# Altium schematic sheet Multi-sensor Datalogger.SchDoc
size A3
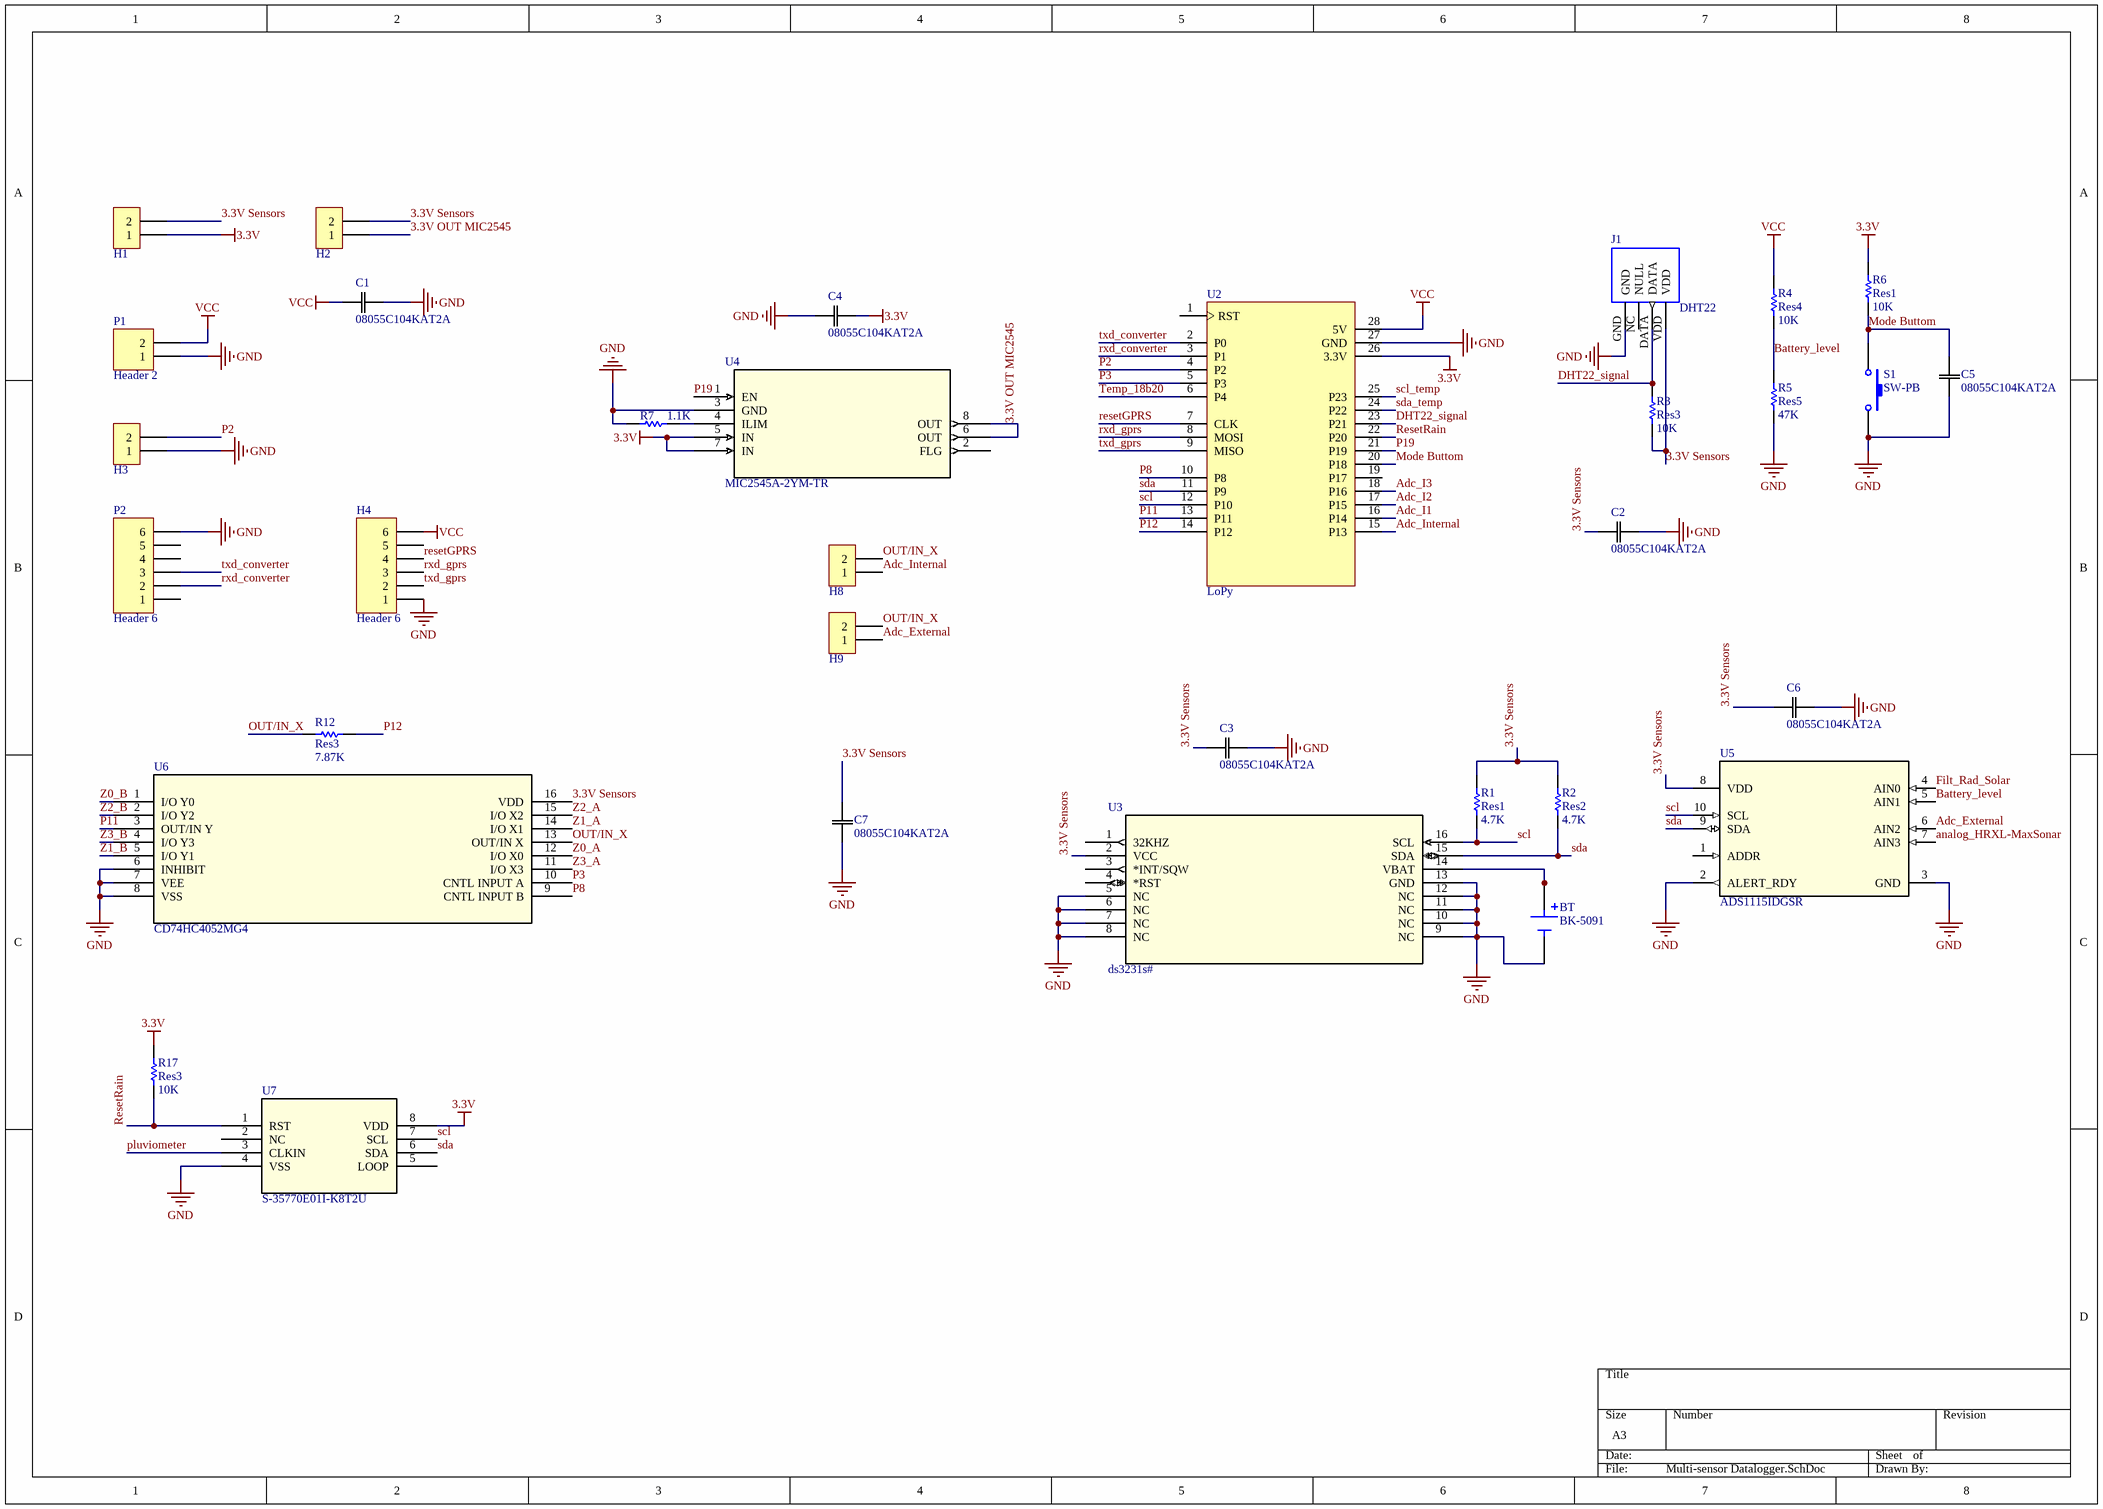
[diagram p0: Multi-sensor Datalogger.SchDoc]

## Parts
BT  BK-5091  [BAT_BK-5091]
C1  08055C104KAT2A  [CAP_X7R_0805_AVX]
C2  08055C104KAT2A  [CAP_X7R_0805_AVX]
C3  08055C104KAT2A  [CAP_X7R_0805_AVX]
C4  08055C104KAT2A  [CAP_X7R_0805_AVX]
C5  08055C104KAT2A  [CAP_X7R_0805_AVX]
C6  08055C104KAT2A  [CAP_X7R_0805_AVX]
C7  08055C104KAT2A  [CAP_X7R_0805_AVX]
H1  Header  [Header 1X2]  (value not drawn)
H2  Header  [Header 1X2]  (value not drawn)
H3  Header  [Header 1X2]  (value not drawn)
H4  Header 6  [Header 1X6]
H8  Header  [Header 1X2]  (value not drawn)
H9  Header  [Header 1X2]  (value not drawn)
J1  DHT22  [DHT22]
P1  Header 2  [BORNERA25-2]
P2  Header 6  [HDR1X6]
R1  Res1  value 4.7K  [6-0805_N]
R2  Res2  value 4.7K  [6-0805_N]
R3  Res3  value 10K  [6-0805_N]
R4  Res4  value 10K  [6-0805_N]
R5  Res5  value 47K  [6-0805_N]
R6  Res1  value 10K  [6-0805_N]
R7  value 1.1K  [6-0805_N]
R12  Res3  value 7.87K  [6-0805_N]
R17  Res3  value 10K  [6-0805_N]
S1  SW-PB  [BUTTON-1-SMD]
U2  LoPy  [LoPy]
U3  ds3231s#  [21-0042B_16_MXM]
U4  MIC2545A-2YM-TR  [SOP-8_MCH]
U5  ADS1115IDGSR  [DGS0010A_L]
U6  CD74HC4052MG4  [D16_TEX]
U7  S-35770E01I-K8T2U  [TMSOP08_2P9X2P8_ABL]

## Nets
3.3V: C4.1 H1.1 R6.1 R17.1 U2.26(3.3V) U4.5(IN) U4.7(IN) U7.8(VDD)
GND: BT.NEG C1.1 C2.1 C3.1 C4.2 C5.1 C6.1 C7.1 H3.1 H4.1 J1.GND P1.1 P2.6 R5.2 R7.1 S1.2 U2.27(GND) U3.5(NC) U3.6(NC) U3.7(NC) U3.8(NC) U3.9(NC) U3.10(NC) U3.11(NC) U3.12(NC) U3.13(GND) U4.3(GND) U5.2(ALERT_RDY) U5.3(GND) U6.6(INHIBIT) U6.7(VEE) U6.8(VSS) U7.4(VSS)
VCC: C1.2 H4.6 P1.2 R4.1 U2.28(5V)
3.3V OUT MIC2545: H2.1 U4.6(OUT) U4.8(OUT)
3.3V Sensors: C2.2 C3.2 C6.2 C7.2 H1.2 H2.2 J1.VDD R1.1 R2.1 R3.2 U3.2(VCC) U5.8(VDD) U6.16(VDD)
Adc_External: H9.1 U5.6(AIN2)
Adc_I1: U2.16(P14)
Adc_I2: U2.17(P15)
Adc_I3: U2.18(P16)
Adc_Internal: H8.1 U2.15(P13)
analog_HRXL-MaxSonar: U5.7(AIN3)
Battery_level: R4.2 R5.1 U5.5(AIN1)
DHT22_signal: J1.DATA R3.1 U2.23(P21)
Filt_Rad_Solar: U5.4(AIN0)
Mode Buttom: C5.2 R6.2 S1.1 U2.20(P18)
OUT/IN_X: H8.2 H9.2 R12.1 U6.13(OUT/IN_X)
P2: H3.2 U2.4(P2)
P3: U2.5(P3) U6.10(CNTL_INPUT_A)
P8: U2.10(P8) U6.9(CNTL_INPUT_B)
P11: U2.13(P11) U6.3(OUT/IN_Y)
P12: R12.2 U2.14(P12)
P19: U2.21(P19) U4.1(EN)
pluviometer: U7.3(CLKIN)
resetGPRS: H4.4 U2.7(CLK)
ResetRain: R17.2 U2.22(P20) U7.1(RST)
rxd_converter: P2.2 U2.3(P1)
rxd_gprs: H4.3 U2.8(MOSI)
scl: R1.2 U2.12(P10) U3.16(SCL) U5.10(SCL) U7.7(SCL)
scl_temp: U2.25(P23)
sda: R2.2 U2.11(P9) U3.15(SDA) U5.9(SDA) U7.6(SDA)
sda_temp: U2.24(P22)
Temp_18b20: U2.6(P4)
txd_converter: P2.3 U2.2(P0)
txd_gprs: H4.2 U2.9(MISO)
Z0_A: U6.12(I/O_X0)
Z0_B: U6.1(I/O_Y0)
Z1_A: U6.14(I/O_X1)
Z1_B: U6.5(I/O_Y1)
Z2_A: U6.15(I/O_X2)
Z2_B: U6.2(I/O_Y2)
Z3_A: U6.11(I/O_X3)
Z3_B: U6.4(I/O_Y3)
NetBT_1+: BT.1+(POS) BT.2+(POS) U3.14(VBAT)
NetR7_2: R7.2 U4.4(ILIM)

Not connected (* = marked no-connect by the designer): H4 5; J1 NC(NULL); P2 1 4 5; U2 1(RST) 19(P17); U3 1(32KHZ) 3(*INT/SQW) 4(*RST); U4 2(FLG); U5 1(ADDR); U7 2(NC) 5(LOOP)

## Library data of the parts
BT = BK-5091: Battery Retainer Coin, 11.6mm 1 Cell PC Pin; MF: MPD; SnapEDA_Link: https://www.snapeda.com/parts/BK-5091/MPD/view-part/4480565/?ref=snap; Value: *; MP: BK-5091; DigiKey-Purchase-URL: https://snapeda.com/shop?store=DigiKey&id=4480565; Package: None; Digi-Key_Part_Number: BK-5091-ND
C1-C7 = 08055C104KAT2A: No Description Available; Vendor: AVX Corporation; Built_By: EMA_UL_Team; SourceLibrary: AVX_2012-08-08; Type: DEV; Manufacturer_Part_Number: 08055C104KAT2A; Copyright: Copyright (C) 2018 Accelerated Designs. All rights reserved; RefDes: RefDes
H1-H3 H8 H9 = Header 2: Header 2 pin
H4 P2 = Header 6: Header, 6-Pin; LatestRevisionDate: 17-Jul-2002; LatestRevisionNote: Re-released for DXP Platform.; Publisher: Altium Limited
J1 = DHT22: Capacitive-type humidity and temperature module/sensor; MF: Aosong Electronics; MP: DHT22; Value: *; Check_prices: https://www.snapeda.com/parts/DHT22/Aosong%20Electronics/view-part/5164503/?ref=eda; Package: Package; Availability: Unavailable; Price: None; SnapEDA_Link: https://www.snapeda.com/parts/DHT22/Aosong%20Electronics/view-part/5164503/?ref=snap
P1 = Header 2: Header, 2-Pin; LatestRevisionDate: 17-Jul-2002; LatestRevisionNote: Re-released for DXP Platform.; Publisher: Altium Limited
R1-R7 R12 R17 = Res1: Resistor; Published: 8-Jun-2000; LatestRevisionDate: 17-Jul-2002; LatestRevisionNote: Re-released for DXP Platform.; PackageReference: AXIAL-0.3; Publisher: Altium Limited; PackageDescription: Axial Device, Thru-Hole; 2 Leads; 0.3 in Pin Spacing
S1 = SW-PB: Switch; Published: 24-Mar-1999; LatestRevisionDate: 17-Jul-2002; LatestRevisionNote: Re-released for DXP Platform.; PackageReference: SPST-2; Publisher: Altium Limited; PackageDescription: Switch; 2 Leads
U2 = LoPy: LoPy, Wifi and Bluetooth Microcontroller, 4M RAM, 4 MHz, 28-Pin, 3.0 to 5.5V Supply Range, Commercial Temperature; ComponentAvailability: Unknown. Contact manufacturer to determine status.; Published: 11-Oct-2004; LatestRevisionDate: 29-Jan-2009; LatestRevisionNote: Sch. layout revised. 3D Model Removed.; DatasheetVersion: revD, Mar-2002; PackageVersion: revBB, Aug-2009; PackageReference: PDIP600-P28; Publisher: Altium Limited; PackageDescription: 28-Lead Plastic Dual In-Line (P) - 600 mil Body [PDIP]; Supplier 1: Digi-Key; Supplier Part Number 1: PIC16C55A-04/P-ND; Supplier 2: Farnell; Supplier Part Number 2: 1523784; Supplier 3: Farnell; Supplier Part Number 3: 1084287; Code_JEDEC: MO-011; ComponentLink1Description: Datasheet; ComponentLink1URL: http://ww1.microchip.com/downloads/en/DeviceDoc/30453d.pdf; ComponentLink2Description: Packaging Specification; ComponentLink2URL: http://www.microchip.com/stellent/groups/techpub_sg/documents/packagingspec/en012702.pdf; ComponentLink3Description: Microchip.com Home; ComponentLink3URL: http://www.microchip.com/
U3 = ds3231s#: No Description Available; Vendor: Maxim Integrated Products; Built_By: EMA_UL_Team; SourceLibrary: Maxim_2009-12-17_1; Manufacturer_Part_Number: ds3231s#; Copyright: Copyright (C) 2018 Accelerated Designs. All rights reserved; RefDes: RefDes; Type: DEV
U4 = MIC2545A-2YM-TR: No Description Available; Vendor: Microchip; Built_By: EMA_Molly; SourceLibrary: Microchip_2019-09-03; Manufacturer_Part_Number: MIC2545A-2YM-TR; Copyright: Copyright (C) 2018 Accelerated Designs. All rights reserved; RefDes: RefDes; Type: DEV
U5 = ADS1115IDGSR: No Description Available; Manufacturer: Texas Instruments; PartNumber: ADS1115IDGSR; RefDes: RefDes; Type: DEV; Value: Value; Copyright: Copyright (C) 2018 Accelerated Designs. All rights reserved
U6 = CD74HC4052MG4: No Description Available; Vendor: Texas Instruments; Built_By: EMA_UL_Team; SourceLibrary: TI_2011-11-28; Manufacturer_Part_Number: CD74HC4052MG4; Copyright: Copyright (C) 2021 Accelerated Designs. All rights reserved; RefDes: RefDes; Type: DEV
U7 = S-35770E01I-K8T2U: No Description Available; Vendor: ABLIC; SourceLibrary: Add_to_database_2021-02-18; Datasheet: https://www.ablic.com/en/doc/datasheet/counter_ic/S35770_I_E.pdf; Copyright: Copyright (C) 2018 Accelerated Designs. All rights reserved; Manufacturer_Part_Number: S-35770E01I-K8T2U; RefDes: RefDes; Type: DEV